# EAGLE design OpenEVSE_PLUS_v5 (EAGLE 8.5.0)
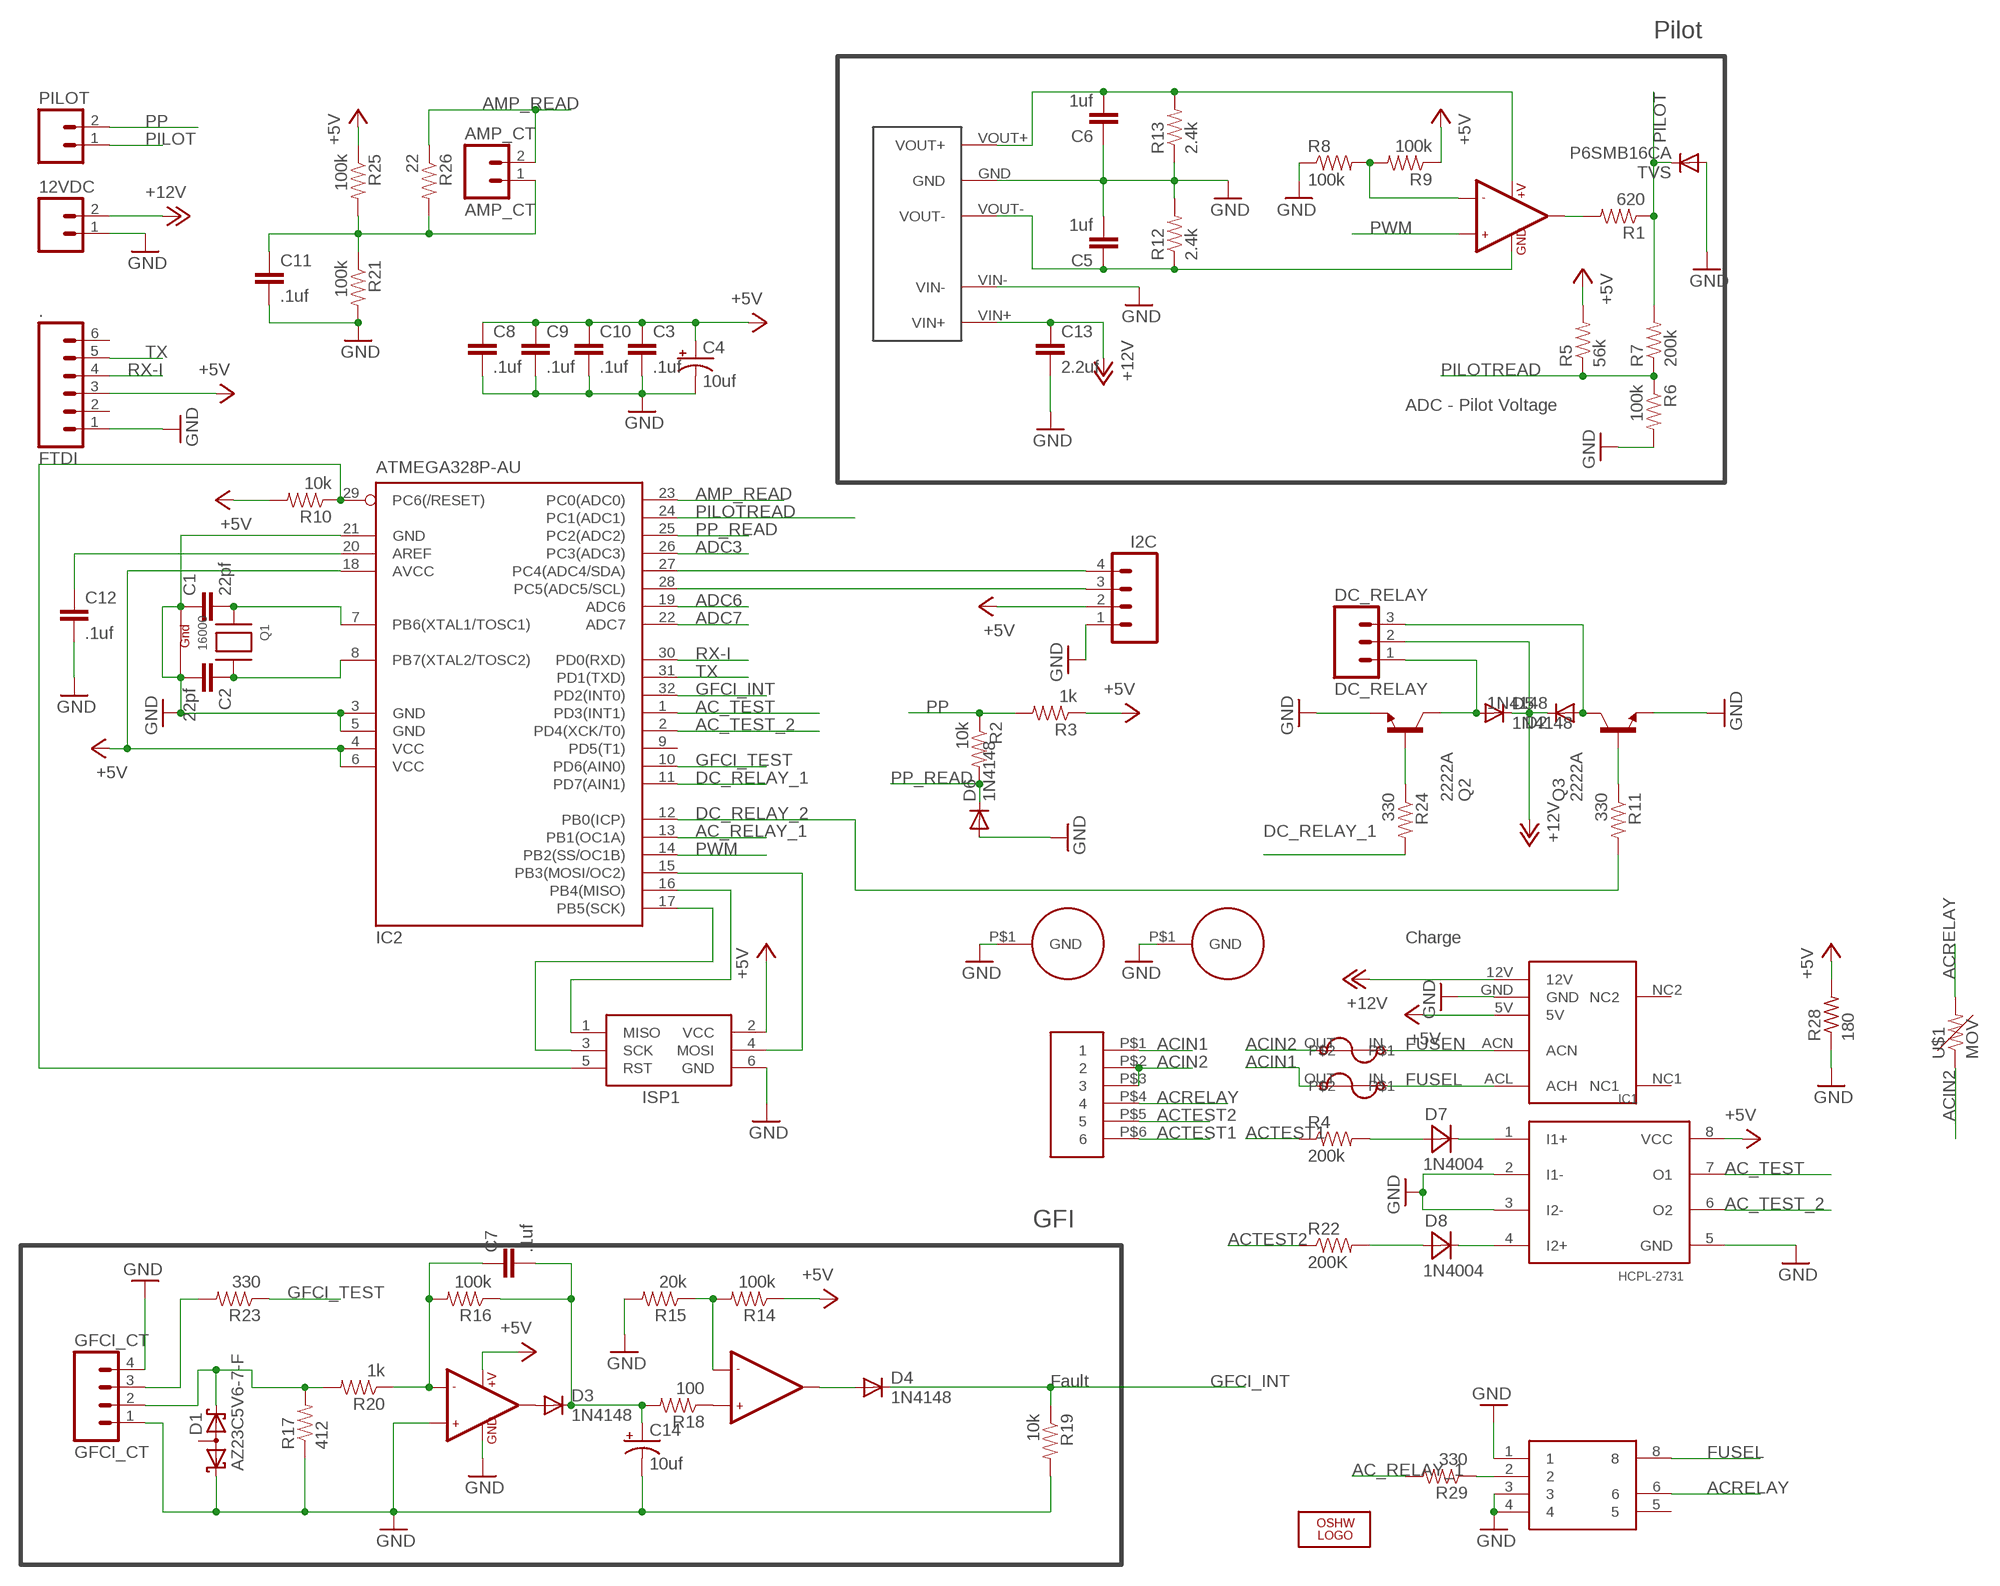
[diagram p0: schematic, sheet 1]

## Parts
12VDC  M023.5MM  [SCREWTERMINAL-3.5MM-2]
.  FTDI  M06LOCK  [1X06_LOCK]
AC  JST-VH-6  [JST-VH-6]
AMP_CT  AMP_CT  MOLEX_2  [MOLEX_2]
C1  22pf  CAP0805  [0805]
C2  22pf  CAP0805  [0805]
C3  .1uf  CAP0805  [0805]
C4  10uf  CAP_POL1206  [EIA3216]
C5  1uf  CAP0805  [0805]
C6  1uf  CAP0805  [0805]
C7  .1uf  CAP0805  [0805]
C8  .1uf  CAP0805  [0805]
C9  .1uf  CAP0805  [0805]
C10  .1uf  CAP0805  [0805]
C11  .1uf  CAP0805  [0805]
C12  .1uf  CAP0805  [0805]
C13  2.2uf  CAP0805  [0805]
C14  10uf  CAP_POL1206  [EIA3216]
D1  AZ23C5V6-7-F  BAS40-06  [SOT23]
D2  1N4148  DIODE-SOD123  [SOD123]
D3  1N4148  DIODE-SOD123  [SOD123]
D4  1N4148  DIODE-SOD123  [SOD123]
D5  1N4148  DIODE-SOD123  [SOD123]
D6  1N4148  DIODE-SOD123  [SOD123]
D7  1N4004  MBRA340T3  [SMA]
D8  1N4004  MBRA340T3  [SMA]
DC_RELAY  DC_RELAY  MOLEX_3  [MOLEX_3]
DCDC  MD112D-12E  DCDC_SIP  [DCDC_SIP]
F1  BEL1AFUSE  [BELFUSE1A]
F2  BEL1AFUSE  [BELFUSE1A]
GFCI_CT  GFCI_CT  GFCI_4  [GFCI_4]
I2C  M04LOCK  [1X04_LOCK]
IC1  HCPL-2731  [DIP08]
IC2  ATMEGA328P-AU  MEGA8-AI  [TQFP32-08]
IC3  LM358  LMV358  [SO08]
IC4  LF353  LMV358  [SO08]
IC5  AQH1213  [DIP7]
ISP1  AVRISP-6  [AVRISP]
LOGO1  OSHW_LOGO_8MILX0150-NT  [OSHW_8X150_NOTEXT]
PILOT  M023.5MM  [SCREWTERMINAL-3.5MM-2]
PS1  MPM-04E-1205  [MPM-04E-1205]
Q1  16000  XTAL-4-3225  [NX3225]
Q2  2222A  BCX70SMD  [SOT23]
Q3  2222A  BCX70SMD  [SOT23]
R1  620  RESISTOR0805-RES  [0805]
R2  10k  RESISTOR0805-RES  [0805]
R3  1k  RESISTOR0805-RES  [0805]
R4  200k  RESISTORPTH-1/4W  [AXIAL-0.4]
R5  56k  RESISTOR0805-RES  [0805]
R6  100k  RESISTOR0805-RES  [0805]
R7  200k  RESISTOR0805-RES  [0805]
R8  100k  RESISTOR0805-RES  [0805]
R9  100k  RESISTOR0805-RES  [0805]
R10  10k  RESISTOR0805-RES  [0805]
R11  330  RESISTOR0805-RES  [0805]
R12  2.4k  RESISTOR0805-RES  [0805]
R13  2.4k  RESISTOR0805-RES  [0805]
R14  100k  RESISTOR0805-RES  [0805]
R15  20k  RESISTOR0805-RES  [0805]
R16  100k  RESISTOR0805-RES  [0805]
R17  412  RESISTOR0805-RES  [0805]
R18  100  RESISTOR0805-RES  [0805]
R19  10k  RESISTOR0805-RES  [0805]
R20  1k  RESISTOR0805-RES  [0805]
R21  100k  RESISTOR0805-RES  [0805]
R22  200K  RESISTORPTH-1/4W  [AXIAL-0.4]
R23  330  RESISTOR0805-RES  [0805]
R24  330  RESISTOR0805-RES  [0805]
R25  100k  RESISTOR0805-RES  [0805]
R26  22  RESISTOR0805-RES  [0805]
R28  180  R-US_R1206  [R1206]
R29  330  RESISTOR0805-RES  [0805]
TVS  P6SMB16CA  DIODE-SMB  [SMB]
U$1  MOV  [MOV]
U$3  HOLE  [HOLE]
U$4  HOLE  [HOLE]

## Nets
12V: C6.2 DCDC.VOUT+ IC4.8(+V) R13.2
+5V: ..3 C3.1 C4.A(+) C8.1 C9.1 C10.1 I2C.2 IC1.8(VCC) IC2.4(VCC) IC2.6(VCC) IC2.18(AVCC) IC3.8(+V) ISP1.2(VCC) PS1.5V R3.1 R5.2 R9.1 R10.2 R14.1 R25.1 R28.2
+12V: 12VDC.2 C13.1 D2.C D5.C DC_RELAY.2 DCDC.VIN+ PS1.12V
-12V: C5.1 DCDC.VOUT- IC4.4(GND) R12.1
AC_RELAY_1: IC2.13(PB1(OC1A)) R29.2
AC_TEST: IC1.7(O1) IC2.1(PD3(INT1))
AC_TEST_2: IC1.6(O2) IC2.2(PD4(XCK/T0))
ACIN1: AC.P$1 F2.OUT
ACIN2: AC.P$2 AC.P$3 F1.OUT U$1.P$1
ACRELAY: AC.P$4 IC5.6 U$1.P$2
ACTEST1: AC.P$6 R4.P$1
ACTEST2: AC.P$5 R22.P$1
ADC3: IC2.26(PC3(ADC3))
ADC6: IC2.19(ADC6)
ADC7: IC2.22(ADC7)
AMP_READ: AMP_CT.2 IC2.23(PC0(ADC0)) R26.1
DC_RELAY_1: IC2.11(PD7(AIN1)) R24.2
DC_RELAY_2: IC2.12(PB0(ICP)) R11.2
FUSEL: F2.IN IC5.8 PS1.ACL(ACH)
FUSEN: F1.IN PS1.ACN
GFCI_INT: D4.C IC2.32(PD2(INT0)) R19.1
GFCI_TEST: IC2.10(PD6(AIN0)) R23.1
GND: 12VDC.1 ..1 C1.1 C2.2 C3.2 C4.C(-) C5.2 C6.1 C8.2 C9.2 C10.2 C11.2 C12.2 C13.2 C14.C(-) D1.1(K1) D6.A DCDC.GND DCDC.VIN- GFCI_CT.1 GFCI_CT.4 I2C.1 IC1.2(I1-) IC1.3(I2-) IC1.5(GND) IC2.3(GND) IC2.5(GND) IC2.21(GND) IC3.3(+IN1) IC3.4(GND) IC5.1 IC5.3 IC5.4 ISP1.6(GND) PS1.GND Q1.1(G1) Q1.3(G2) Q2.2(E) Q3.2(E) R6.2 R8.1 R12.2 R13.1 R15.2 R17.1 R19.2 R21.2 R28.1 TVS.A U$3.P$1(GND) U$4.P$1(GND)
N$1: D2.A DC_RELAY.3 Q3.3(C)
N$2: Q3.1(B) R11.1
N$4: C1.2 IC2.7(PB6(XTAL1/TOSC1)) Q1.2(X1)
N$5: C2.1 IC2.8(PB7(XTAL2/TOSC2)) Q1.4(X2)
N$6: D5.A DC_RELAY.1 Q2.3(C)
N$7: AMP_CT.1 C11.1 R21.1 R25.2 R26.2
N$8: C7.1 IC3.2(-IN1) R16.2 R20.1
N$9: D7.A R4.P$2
N$10: IC4.2(-IN1) R8.2 R9.2
N$11: IC4.1(OUT1) R1.2
N$12: D7.C IC1.1(I1+)
N$13: D8.C IC1.4(I2+)
N$14: IC2.15(PB3(MOSI/OC2)) ISP1.4(MOSI)
N$15: IC2.17(PB5(SCK)) ISP1.3(SCK)
N$16: IC2.16(PB4(MISO)) ISP1.1(MISO)
N$17: D8.A R22.P$2
N$18: IC5.2 R29.1
N$20: D1.2(K2) GFCI_CT.2 R17.2 R20.2
N$21: D3.A IC3.1(OUT1)
N$22: GFCI_CT.3 R23.2
N$23: C7.2 C14.A(+) D3.C R16.1 R18.2
N$24: IC3.6(-IN2) R14.2 R15.1
N$25: D4.A IC3.7(OUT2)
N$26: IC3.5(+IN2) R18.1
N$30: Q2.1(B) R24.1
N$39: I2C.4 IC2.27(PC4(ADC4/SDA))
N$40: I2C.3 IC2.28(PC5(ADC5/SCL))
N$44: C12.1 IC2.20(AREF)
PILOT: PILOT.1 R1.1 R7.2 TVS.C
PILOTREAD: IC2.24(PC1(ADC1)) R5.1 R6.1 R7.1
PP: PILOT.2 R2.1 R3.2
PP_READ: D6.C IC2.25(PC2(ADC2)) R2.2
PWM: IC2.14(PB2(SS/OC1B)) IC4.3(+IN1)
RST: IC2.29(PC6(/RESET)) ISP1.5(RST) R10.1
RX-I: ..4 IC2.30(PD0(RXD))
TX: ..5 IC2.31(PD1(TXD))
Unconnected: ..2 ..6 D1.3(AA) IC2.9(PD5(T1)) IC4.5(+IN2) IC4.6(-IN2) IC4.7(OUT2) IC5.5 PS1.NC1 PS1.NC2

## Notes on the sheet
- Pilot
- ADC - Pilot Voltage
- Charge
- GFI
- Fault

## Library data of the parts
12VDC PILOT = SparkFun-Connectors:M02: Standard 2-pin 0.1" header. Use with - straight break away headers ( PRT-00116) - right angle break away headers (PRT-00553) - swiss pins (PRT-00743) - machine pins (PRT-00117) - female headers (PRT-00115) Molex polarized connector foot print use with: PRT-08233 with associated crimp pins and housings. 2.54_SCREWTERM for use with PRT-10571. 3.5mm Screw Terminal footprints for PRT-08084 5mm Screw Terminal footprints for use with PRT-08432; PROD_ID: CONN-08399
. = SparkFun:M06: Header 6 Standard 6-pin 0.1" header. Use with straight break away headers (SKU : PRT-00116), right angle break away headers (PRT-00553), swiss pins (PRT-00743), machine pins (PRT-00117), and female headers (PRT-00115). Molex polarized connector foot print use with SKU : PRT-08094 with associated crimp pins and housings. NOTES ON THE VARIANTS LOCK and LOCK_LONGPADS... This footprint was designed to help hold the alignment of a through-hole component (i.e. 6-pin header) while soldering it into place. You may notice that each hole has been shifted either up or down by 0.005 of an inch from it's more standard position (which is a perfectly straight line). This slight alteration caused the pins (the squares in the middle) to touch the edges of the holes. Because they are alternating, it causes a "brace" to hold the component in place. 0.005 has proven to be the perfect amount of "off-center" position when using our standard breakaway headers. Although looks a little odd when you look at the bare footprint, once you have a header in there, the alteration is very hard to notice. Also, if you push a header all the way into place, it is covered up entirely on the bottom side. This idea of altering the position of holes to aid alignment will be further integrated into the Sparkfun Library for other footprints. It can help hold any component with 3 or more connection pins.
AC = OpenEVSE:JST-VH-6
AMP_CT = OpenEVSE:MOLEX_2
C1-C3 C5-C13 = SparkFun:CAP: Capacitor Standard 0603 ceramic capacitor, and 0.1" leaded capacitor.
C4 C14 = SparkFun:CAP_POL: Capacitor Polarized These are standard SMD and PTH capacitors. Normally 10uF, 47uF, and 100uF in electrolytic and tantalum varieties. Always verify the external diameter of the through hole cap, it varies with capacity, voltage, and manufacturer. The EIA devices should be standard.
D1 = diode:BAS40-06: Silicon Schottky Diodes General-purpose diode for high-speed switching
D2-D6 TVS = diode:DIODE-: DIODE
D7 D8 = diode:MBRA340T3: Surface Mount Schottky Power Rectifier Source: http://www.onsemi.com/pub_link/Collateral/MBRA340T3-D.PDF
DC_RELAY = OpenEVSE:MOLEX_3
DCDC = Qxd:DCDC_SIP
F1 F2 = Qxd:BEL1AFUSE
GFCI_CT = OpenEVSE:GFCI_4
I2C = SparkFun:M04: Header 4 Standard 4-pin 0.1" header. Use with straight break away headers (SKU : PRT-00116), right angle break away headers (PRT-00553), swiss pins (PRT-00743), machine pins (PRT-00117), and female headers (PRT-00115). Molex polarized connector foot print use with SKU : PRT-08231 with associated crimp pins and housings. 1MM SMD Version SKU: PRT-10208
IC1 = Qxd:HCPL-2731
IC2 = atmel:MEGA8: MICROCONTROLLER 8 Kbytes FLASH, 1 kbytes SRAM, 512 bytes EEPROM, USART, 6-channel 10 bit ADC, 2-channel 8 bit ADC Pin compatible with Atmega48, ATMega88, ATMega168 Source: avr.lbr; MPN: ATMEGA8-16AU; OC_FARNELL: 9171371; OC_NEWARK: 73M8863
IC3 IC4 = SparkFun:LMV358
IC5 = SparkFun:AQH1213
ISP1 = adafruit:AVRISP: AVR ISP HEADER Standard 6 pin header for AVR programming
LOGO1 = ohw-logo:OSHW_LOGO_8MIL
PS1 = Qxd:MPM-04E-1205
Q1 = adafruit:XTAL-4: Classic 4-pin 3.2 x 2.5mm crystal
Q2 Q3 = transistor-npn:BCX70*: NPN Transistor
R1-R26 R29 = SparkFun:RESISTOR: Resistor Basic schematic elements and footprints for 0603, 1206, and PTH resistors.
R28 = rcl:R-US_: RESISTOR, American symbol
U$1 = OpenEVSE:MOV
U$3 U$4 = OpenEVSE:HOLE

## Board
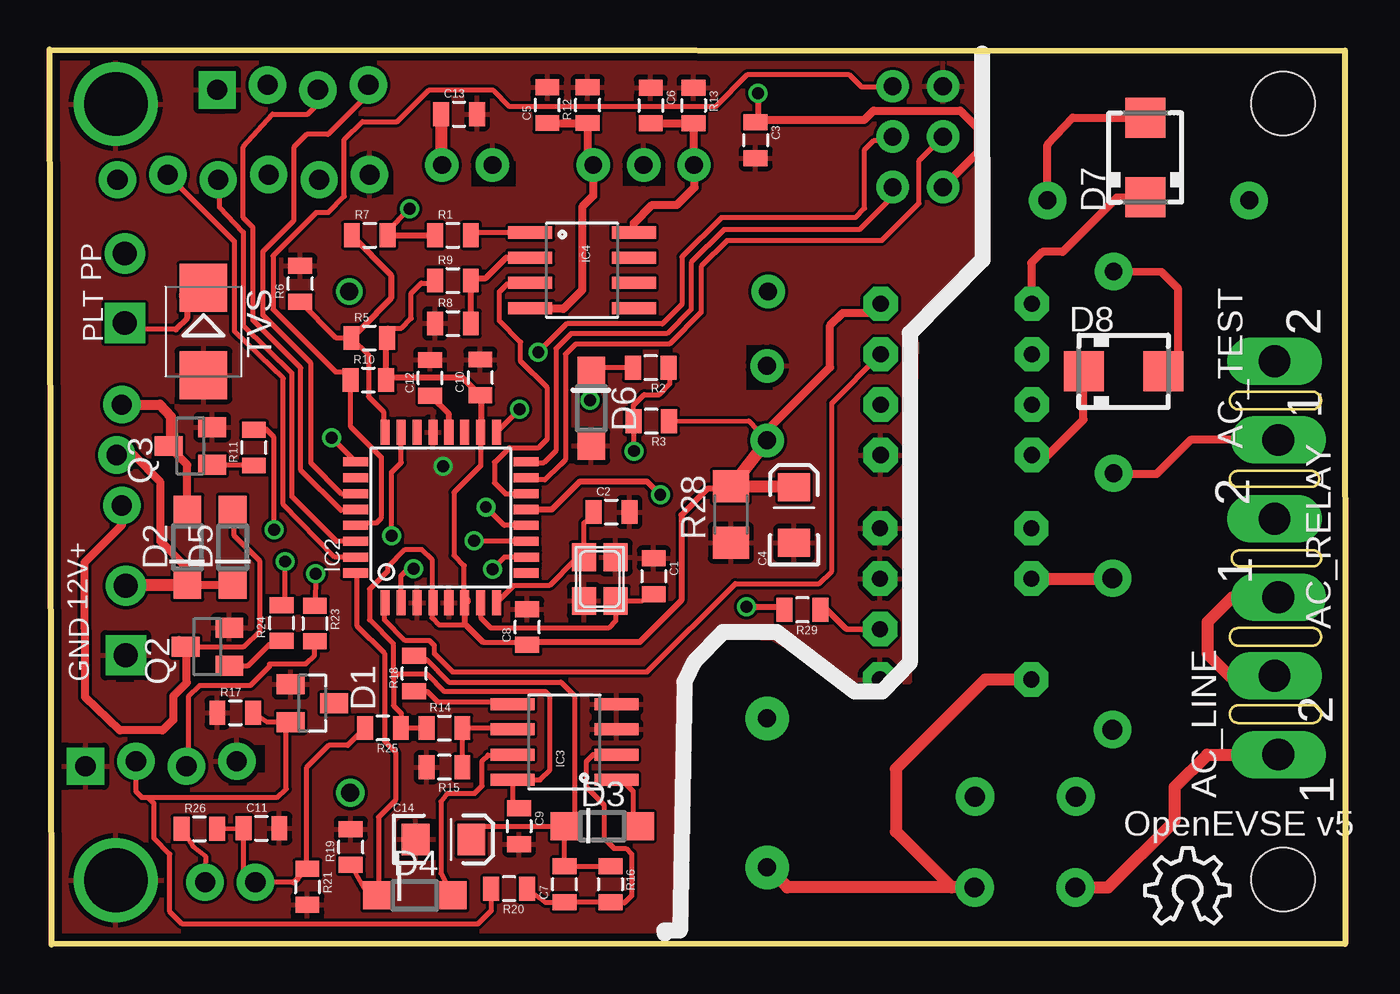
[diagram p1: board, top side]
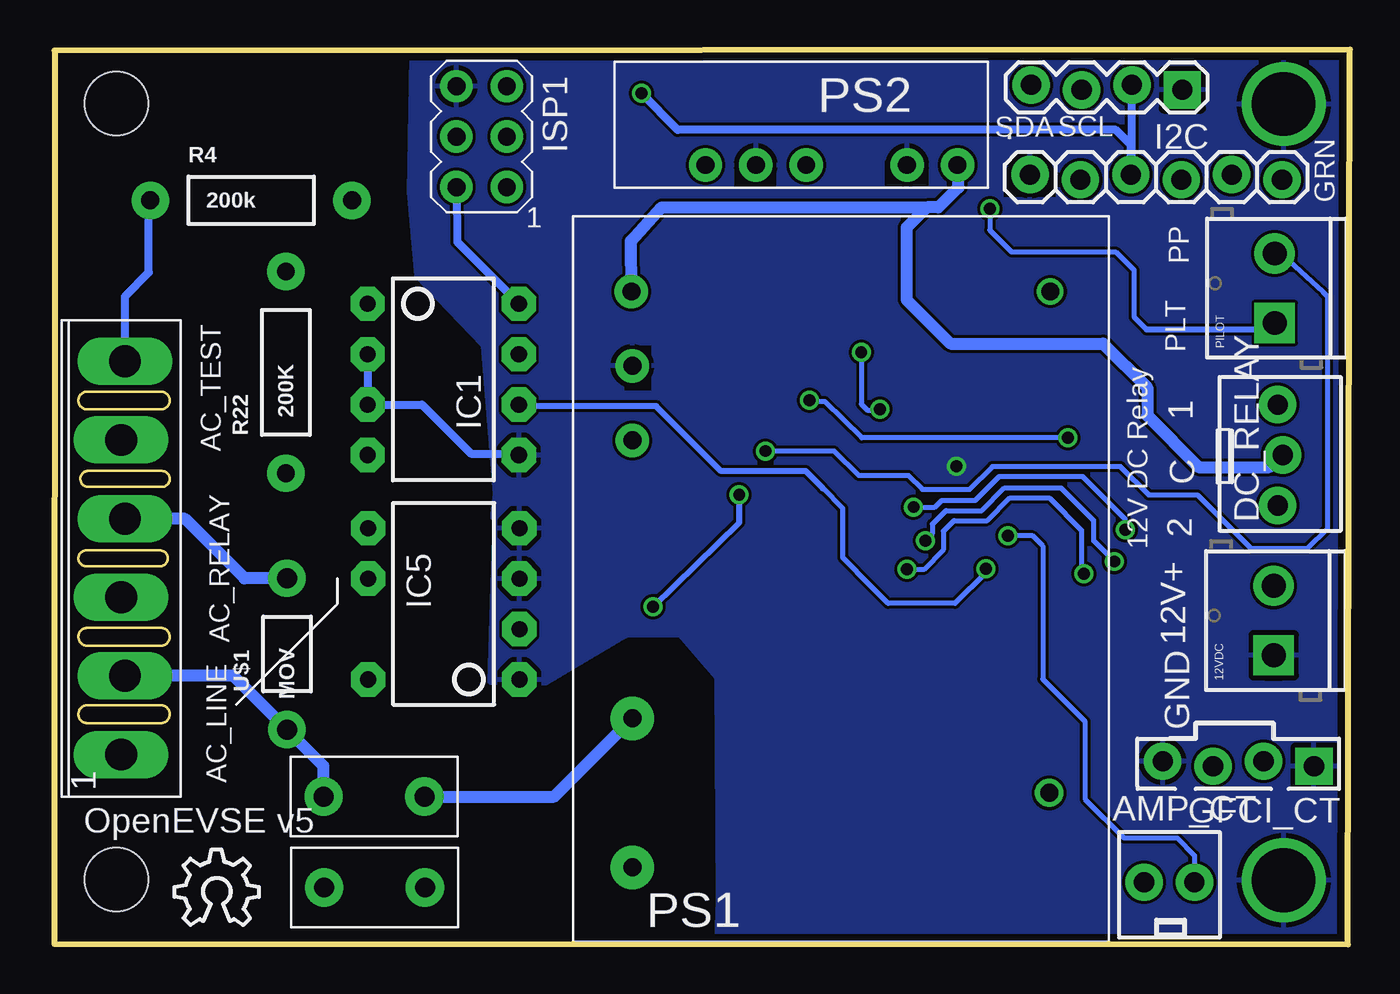
[diagram p2: board, bottom side, seen from below]

Size 65.27 x 45.06 mm. Coordinates in mm from the lower left corner, seen from the top.
Outline: 65.25,45 65.27,0.03 0.1,0 0,45.06 65.25,45
Copper layers (1*16): Top 0.0356mm / dielectric 1.5011mm / Bottom 0.0356mm
Design rules "default": minimum track width 6mil, minimum drill 13mil, track to track 6mil, track to pad 6mil, pad to pad 6mil, via to via 6mil, smd to smd 6mil, copper to edge 15mil, drill to drill 6mil, minimum pad ring 7mil, minimum via ring 7mil, stop-mask expansion 4mil, vias tented up to drill 0mil, thermal gap 10mil
Holes 3.2 mm at 62.13,42.33 62.14,3.27
tRestrict: area 8.1,41.8 to 8.8,44.2; area 14.9,37.8 to 17.3,39; area 21.3,38.2 to 23.5,39.4; area 28.9,38.2 to 31,39.4; area 35.1,27.9 to 36.4,30.2; area 9,8 to 9.9,9.4; area 9,8.1 to 9.9,9.2; area 9.9,8.7 to 10.8,10; area 3.4,14.6 to 4.2,15.8; area 3.4,13.2 to 4.2,14.4
bRestrict: area 8.1,41.8 to 8.7,44.2; area 14.8,37.6 to 17.4,38.9; area 21.2,38.2 to 23.4,39.5; area 28.9,38.1 to 31,39.5; area 35.2,27.9 to 36.5,30.2; area 3.4,14.7 to 4.3,15.8; area 3.4,13.3 to 4.3,15.4

### Footprints (pad centres in the part's own frame; a part is rotated, then mirrored left to right if it is on the bottom)
SCREWTERMINAL-3.5MM-2 = drill 1.2 pad 2.032 square: 1 0,0 | drill 1.2 pad 2.032: 2 3.5,0
1X06_LOCK = drill 1.016 pad 1.88: 1 0,0; 2 2.54,-0.254; 3 5.08,0; 4 7.62,-0.254; 5 10.16,0; 6 12.7,-0.254
JST-VH-6 = drill 1.6 pad 1.93 long: P$1 0,11.88; P$2 -0.2,7.92; P$3 0,3.96; P$4 -0.2,0; P$5 0,-3.96; P$6 -0.2,-7.92
MOLEX_2 = drill 1.016 pad 1.88: 1 -1.27,0; 2 1.27,0
0805 = smd 0.8 x 1.2: 1 -0.9,0; 2 0.9,0
EIA3216 = smd 1.4 x 1.6: A 1.4,0; C -1.4,0
SOT23 = smd 1 x 1.4: 1 -0.95,-1.1; 2 0.95,-1.1; 3 0,1.1
SOD123 = smd 1.4 x 1.4: A 1.9,0; C -1.9,0
SMA = smd 2 x 2: A 2,0; C -2,0
MOLEX_3 = drill 1.016 pad 1.88: 1 -2.54,0.127; 2 0,-0.127; 3 2.54,0.127
DCDC_SIP = drill 0.9 pad 1.676: GND 10.16,0; VIN+ 0,0; VIN- 2.54,0; VOUT+ 12.7,0; VOUT- 7.62,0
BELFUSE1A = drill 1 pad 1.93: IN 2,1.66; OUT 2,6.74
GFCI_4 = drill 1.016 pad 1.88 square: 1 0,0.127 | drill 1.016 pad 1.88: 2 2.54,-0.127; 3 5.08,0.127; 4 7.62,-0.127
1X04_LOCK = drill 1.016 pad 1.88 square: 1 0,0.127 | drill 1.016 pad 1.88: 2 2.54,-0.127; 3 5.08,0.127; 4 7.62,-0.127
DIP08 = drill 0.813 pad 1.727 octagon: 1 -3.81,-3.81; 2 -1.27,-3.81; 3 1.27,-3.81; 4 3.81,-3.81; 5 3.81,3.81; 6 1.27,3.81; 7 -1.27,3.81; 8 -3.81,3.81
TQFP32-08 = smd 1.27 x 0.457: 1 -4.293,2.8; 2 -4.293,2; 3 -4.293,1.2; 4 -4.293,0.4; 5 -4.293,-0.4; 6 -4.293,-1.2; 7 -4.293,-2; 8 -4.293,-2.8; 17 4.293,-2.8; 18 4.293,-2; 19 4.293,-1.2; 20 4.293,-0.4; 21 4.293,0.4; 22 4.293,1.2; 23 4.293,2; 24 4.293,2.8 | smd 0.457 x 1.27: 9 -2.8,-4.293; 10 -2,-4.318; 11 -1.2,-4.293; 12 -0.4,-4.293; 13 0.4,-4.293; 14 1.2,-4.293; 15 2,-4.293; 16 2.8,-4.293; 25 2.8,4.293; 26 2,4.293; 27 1.2,4.293; 28 0.4,4.293; 29 -0.4,4.293; 30 -1.2,4.293; 31 -2,4.293; 32 -2.8,4.293
SO08 = smd 0.61 x 2.21: 1 -1.905,-2.616; 2 -0.635,-2.616; 3 0.635,-2.616; 4 1.905,-2.616; 5 1.905,2.616; 6 0.635,2.616; 7 -0.635,2.616; 8 -1.905,2.616
DIP7 = drill 0.813 pad 1.727 octagon: 1 -3.81,-3.81; 2 -1.27,-3.81; 3 1.27,-3.81; 4 3.81,-3.81; 5 3.81,3.81; 6 1.27,3.81; 8 -3.81,3.81
AVRISP = drill 0.9 pad 1.626: 1 -1.27,2.54; 2 1.27,2.54; 3 -1.27,0; 4 1.27,0; 5 -1.27,-2.54; 6 1.27,-2.54
MPM-04E-1205 = drill 0.9 pad 1.676: 5V 3,25.25; 12V 2.95,32.75; GND 3,29 | drill 0.9 pad 2.184: ACL 3,3.75; ACN 3,11.25 | drill 0.9 pad 1.422: NC1 24,7.5 | drill 0.9: NC2 24.05,32.75
NX3225 = smd 1.4 x 1.2: 1 -1.1,0.8; 2 1.1,0.8; 3 1.1,-0.8; 4 -1.1,-0.8
AXIAL-0.4 = drill 0.9 pad 1.88: P$1 -5.08,0; P$2 5.08,0
R1206 = smd 1.6 x 1.803: 1 -1.422,0; 2 1.422,0
SMB = smd 2.4 x 2.4: A 2.2,0; C -2.2,0
MOV = drill 1 pad 1.88: P$1 -8.89,2.54; P$2 -1.27,2.54
HOLE = drill 3.2 pad 3.81: P$1 0,0

### Placement (x,y rotation side)
12VDC  3.84,14.56 90 bottom
.  16.11,38.76 0 bottom
AC  61.91,21.44 180 bottom
AMP_CT  9.1,3.13 0 bottom
C1  30.43,18.54 270 top
C2  28.31,21.77 0 top
C3  35.57,40.49 270 top
C4  37.5,21.62 90 top
C5  25.07,42.26 90 top
C6  30.28,42.25 270 top
C7  25.94,3.02 90 top
C8  24.06,15.98 90 top
C9  23.65,5.95 270 top
C10  21.7,28.55 90 top
C11  10.67,5.84 0 top
C12  19.17,28.53 90 top
C13  20.63,41.81 0 top
C14  19.84,5.28 0 top
D1  13.24,12.14 270 top
D2  6.94,19.99 90 top
D3  27.84,5.95 0 top
D4  18.39,2.47 0 top
D5  9.23,19.99 90 top
D6  27.28,27 270 top
D7  55.2,39.63 90 top
D8  54.11,28.86 0 top
DC_RELAY  3.51,24.64 90 bottom
DCDC  19.77,39.24 180 bottom
F1  44.96,5.44 90 bottom
F2  44.94,0.87 90 bottom
GFCI_CT  1.81,9.09 180 bottom
I2C  8.44,43.16 180 bottom
IC1  45.67,28.45 270 bottom
IC2  19.71,21.5 90 top
IC3  25.94,10.19 90 top
IC4  26.82,33.95 270 top
IC5  45.65,17.15 90 bottom
ISP1  43.74,40.68 180 bottom
LOGO1  55.2,1.04 0 top
LOGO2  OSHW_LOGO_8MILX0150-NT  [OSHW_8X150_NOTEXT]  59.21,0.97 0 bottom
PILOT  3.79,31.29 90 bottom
PS1  39.15,0.13 0 bottom
Q1  27.72,18.39 270 top
Q2  7.96,14.99 90 top
Q3  7.09,25.1 90 top
R1  20.32,35.71 0 top
R2  30.28,29.03 180 top
R3  30.31,26.34 180 top
R4  55.35,37.47 0 bottom
R5  16.1,30.53 0 top
R6  12.63,33.27 90 top
R7  16.13,35.71 0 top
R8  20.32,31.27 0 top
R9  20.32,33.43 0 top
R10  16.06,28.42 0 top
R11  10.29,25.02 90 top
R12  27.11,42.26 90 top
R13  32.44,42.25 270 top
R14  19.89,10.9 0 top
R15  19.89,8.92 180 top
R16  28.25,3.02 270 top
R17  9.35,11.66 0 top
R18  18.37,13.64 90 top
R19  15.17,4.9 90 top
R20  23.14,2.8 180 top
R21  12.98,2.9 270 top
R22  53.6,28.81 90 bottom
R23  13.37,16.16 270 top
R24  11.69,16.18 90 top
R25  16.79,10.9 180 top
R26  7.55,5.82 0 top
R28  34.32,21.64 90 top
R29  37.93,16.84 180 top
TVS  7.75,30.86 270 top
U$1  51,19.7 90 bottom
U$3  3.33,42.32 0 top
U$4  3.33,3.23 0 top

### Tracks (layer width: path | path; a pad name or v marks a point on that pad's centre or on a via)
12V
  Top 0.254: 32.47,41.33 32.38,41.4 R13.2
  Top 0.305: 32.47,41.33 32.31,41.43
  Top 0.406: C6.2 R13.2 32.47,41.32 DCDC.VOUT+ 32.49,39.22 32.49,38.13 31.6,37.24 30.36,37.24 29.44,36.32 IC4.8
+5V  (via drill 0.6)
  Top 0.254: R5.2 17.03,31.04 17.73,31.04 18.22,31.52 18.22,32.79 18.73,33.3 19.49,33.3 19.49,33.36 R9.1 | IC2.18 21.77,25.85 | 21.01,16.79 21.01,17.11 IC2.6 20.88,17.23 | 17.4,13.67 17.51,13.56 17.53,13.59 19.03,13.59 19.89,12.73 24.97,12.73 25.2,12.5 25.2,8.79 24.72,8.31 24.72,8.28 IC3.8 23.32,7.16 23.51,6.97 23.52,6.97 C9.1 | 17.4,13.67 17.33,13.74 | 17.33,13.59 17.33,15.11 16.11,16.33 16.11,17.88 17.05,18.82 17.05,19.03 17.91,19.89 18.75,19.89 19.26,19.38 19.26,16.61 | 17.33,13.59 17.4,13.67 | 20.88,17.17 20.88,17.23 | 20.88,17.23 20.88,19.08 20.38,19.59 20.38,22.76 21.71,24.1 IC2.18 | 31.17,26.52 R3.1 35.21,26.37 PS1.5V | C8.1 24.06,15.14 24.14,15.22 | 19.26,17.26 IC2.4 19.31,16.67 19.26,16.61 | 19.26,16.61 19.26,16.44 19.59,16.11 20.91,16.11 20.93,16.13 | 17.33,13.59 17.33,12.02 17.71,11.63 17.71,10.91 R25.1 R14.1 | IC2.18 21.73,25.81 21.77,25.81 | 21.85,15.22 24.58,15.22
  Top 0.305: 20.95,17.16 IC2.6 20.93,17.18 20.93,16.13 21.85,15.22 | R5.2 16.96,30.82 R10.2 17.09,28.55 20.8,28.55 C10.1 21.77,27.57 21.77,25.81 | 24.14,15.22 24.58,15.22 29.72,15.22 31.83,17.32 31.83,21.62 33.18,22.96 34.22,22.96 R28.2 | v35.69,42.85 35.69,41.52 C3.1
  Top 0.406: IC2.6 21.01,17.3 | 21.01,17.3 20.88,17.17 | 35.69,41.52 41.04,41.52 41.51,41.99 45.88,41.99 46.74,41.12 46.74,39.87 ISP1.2 | PS1.5V 36.08,25.81 39.32,29.06 39.32,31.17 39.96,31.8 41.41,31.8 IC1.8
  Top 0.61: C4.A 37.28,23.06 R28.2 34.45,23.19 PS1.5V
  Bottom 0.406: I2C.2 11,43.28 11,38.79 ..3 11.03,40.27 11.79,41.02 33.86,41.02 v35.69,42.85 | ISP1.2 44.99,38.11 44.96,35.36 IC1.8
+12V
  Top 0.254: C13.1 19.73,41.72 19.82,41.58
  Top 0.406: 19.82,41.58 19.64,41.96 19.74,42.06 | D5.C D2.C | 6.82,18.09 6.89,18.16 6.89,19 5.59,20.3 5.59,23.27 4.27,24.64 DC_RELAY.2
  Top 0.61: 12VDC.2 4.59,18.09 6.82,18.09 D2.C | C13.1 19.73,39.28 DCDC.VIN+
  Bottom 0.61: PS1.12V 36.22,35.41 34.68,37.11 21.32,37.11 | 21.32,37.11 20.73,37.11 19.72,38.13 19.72,39.19 DCDC.VIN+ | 21.32,37.11 22.33,36.09 22.33,32.46 20.12,30.25 12.43,30.25 10.22,28.04 10.22,26.62 7.62,24.03 4.07,24.03 DC_RELAY.2
-12V
  Top 0.254: 27.04,41.36 R12.1
  Top 0.305: 27.04,41.36 27.11,41.43 R12.1
  Top 0.406: C5.1 R12.1 27.11,39.52 DCDC.VOUT- 27.39,37.7 26.83,37.14 26.83,32.95 25.89,32.01 24.24,32.01 IC4.4
AC_RELAY_1  (via drill 0.6)
  Top 0.305: IC2.13 25.31,21.9 26.73,23.32 30.08,23.32 v30.77,22.63 | v35.11,16.99 36.88,16.99 R29.2
  Bottom 0.305: v30.77,22.63 30.77,21.24 v35.11,16.99
AC_TEST
  Top 0.254: IC2.1 16.87,17.17 16.87,16.33 17.91,15.29 19.13,15.29 19.39,15.04 19.39,14.63 20.3,13.72 30.1,13.72 34.55,18.16 38.77,18.16 39.4,18.8 39.4,27.26 IC1.7
AC_TEST_2  (via drill 0.6)
  Top 0.254: v18.34,18.93 17.96,18.82 17.68,18.54 17.68,17.23 IC2.2
  Top 0.305: 17.67,17.17 IC2.2
  Bottom 0.254: 26.55,22.96 25.56,21.97 25.56,19.48 24.16,18.06 23.27,17.17 19.89,17.17 18.34,18.72 v18.34,18.93
  Bottom 0.305: 26.55,22.96 27.41,23.83 31.68,23.83 34.96,27.1 41.79,27.1 IC1.6
ACIN1
  Top 0.61: F2.OUT 53.32,2.87 56.68,6.23 56.68,7.93 58.31,9.56 AC.P$1
ACIN2
  Top 0.61: AC.P$3 59.57,17.48 58.32,16.23 58.32,14.64 59.44,13.52 AC.P$2
  Bottom 0.61: F1.OUT 51.7,8.97 U$1.P$1 56.25,13.52 AC.P$2
ACRELAY
  Top 0.61: IC5.6 53.53,18.42 U$1.P$2
  Bottom 0.61: U$1.P$2 55.69,18.43 58.68,21.43 AC.P$4
ACTEST1
  Bottom 0.406: AC.P$6 61.7,32.64 60.51,33.83 60.51,37.39 R4.P$1
ACTEST2
  Top 0.406: AC.P$5 57.48,25.4 55.76,23.67 53.65,23.67 R22.P$1
AMP_READ  (via drill 0.6)
  Top 0.254: v17.23,20.58 17.23,23.78 17.71,24.26 IC2.23 | R26.1 7.16,5.05 7.24,4.92 7.88,4.41 AMP_CT.2
  Bottom 0.254: v17.23,20.58 15.98,20.58 15.47,20.07 15.47,13.36 13.34,11.23 13.34,7.32 11.38,5.36 8.72,5.36 7.83,4.47 AMP_CT.2
DC_RELAY_1  (via drill 0.6)
  Top 0.254: IC2.11 21.41,20.3 v21.39,20.32 | R24.2 11.87,17.15 v11.87,19.28
  Bottom 0.254: v11.87,19.28 12.91,20.32 12.91,21.34 14.56,22.99 17.4,22.99 18.55,21.85 20.35,21.85 21.04,21.16 21.04,20.68 v21.39,20.32
DC_RELAY_2  (via drill 0.6)
  Top 0.254: IC2.12 22.9,21.1 v21.98,22.02 | v11.31,20.88 11.31,25.53 10.88,25.96 10.34,25.96 R11.2
  Bottom 0.254: v21.98,22.02 20.91,22.02 20.55,22.35 18.88,22.35 17.66,23.57 13.47,23.57 11.33,21.44 11.33,20.91 v11.31,20.88
FUSEL
  Top 0.61: F2.IN 45.45,2.87 | 45.45,2.87 37.16,2.87 PS1.ACL | IC5.8 47.12,13.34 42.63,8.84 42.63,5.69 45.45,2.87
FUSEN
  Bottom 0.61: F1.IN 40.09,7.44 PS1.ACN
GFCI_INT
  Top 0.254: 15.4,18.68 IC2.32 15.5,18.62 15.5,16.03 16.87,14.66 16.87,10.24 17.43,9.68 17.43,7.27 16.57,6.4 16.57,3.12 D4.C 16.2,2.18 R19.1
GFCI_TEST  (via drill 0.6)
  Top 0.254: IC2.10 22.91,19.5 v22.31,18.9 | v13.39,18.67 R23.1
  Bottom 0.254: v22.31,18.9 22.28,18.87 21.47,18.87 20.48,19.86 20.48,20.8 19.94,21.34 18.27,21.34 17.12,22.48 15.14,22.48 13.52,20.86 13.52,18.8 v13.39,18.67
GND  (via drill 0.6)
  Top 0.254: C14.C 18.72,5.42
  Bottom 0.406: IC1.2 IC1.3 46.74,27.18 44.28,24.72 41.94,24.72 IC1.5
  other vias: 19.82,24.08
  pour Bottom: -0.12,45.44 47.27,44.75 47.4,37.87 47.02,33.66 43.67,30.15 43.06,22.66 43.21,21.49 43.11,21.69 43.08,21.34 43.34,13.21 40.52,13.16 36.44,15.56 33.77,15.59 31.91,13.41 31.83,2.21 31.9,0.23 30.66,0.13 29.96,0.21 17.99,0.31 7.64,0.01 0.15,0.06
  pour Top: 0.1,45.22 4.1,45.51 46.76,45.2 47.09,44.45 47.1,34.42 43.41,30.74 43.41,30.61 43.67,30.33 43.31,13.21 40.39,13.13 40.01,13.41 36.43,15.39 33.94,15.5 31.9,13.54 31.9,0.36 30.79,0.43 24.93,0.43 0.09,0.01 0.1,28.97
N$1
  Top 0.406: 5.92,25.03 Q3.3 6.11,24.98 6.94,24.15 D2.A
  Top 0.508: DC_RELAY.3 5.57,27.18 6.11,26.59 6.11,24.98
N$2
  Top 0.254: Q3.1 10.26,24.15 R11.1
N$4
  Top 0.254: C1.2 29.83,17.29 Q1.2 28.52,16.3 28.15,15.93 22.23,15.93 21.75,16.41 21.75,17.17 IC2.7
N$5
  Top 0.254: Q1.4 26.92,21.22 27.23,21.49 27.23,21.6 C2.1 | Q1.4 27.01,19.36 | Q1.4 26.5,19.36 26.48,19.36 25.18,18.06 23.37,18.06 IC2.8
N$6
  Top 0.254: Q2.3 9.78,14.99 10.6,15.8 10.6,19.28 9.3,20.58 9.3,21.19 9.62,21.5
  Top 0.305: 9.62,21.5 D5.A
  Top 0.406: 6.71,14.85 Q2.3 | 6.52,15.32 Q2.3 | Q2.3 6.91,14.93 6.91,13.18 6.23,12.5 6.23,11.3 5.69,10.77 3.54,10.77 1.78,12.45 1.76,19.23 3.64,21.11 DC_RELAY.1
N$7
  Top 0.254: R25.2 15.02,10.02 14.06,10.02 12.93,8.89 12.93,3.85 R21.1 12.52,3.33 | R26.2 C11.1 9.77,3.8 AMP_CT.1 12.31,3.13
  Top 0.305: 12.52,3.33 12.31,3.13
N$8
  Top 0.254: R16.2 C7.1 | 28.23,2.01 28.23,2.1 R16.2 | 25.9,2.08 C7.1 | C7.1 25.92,2.11 24.97,2.11 24.01,2.82 R20.1 | IC3.2 27.39,9.55 27.03,9.2 27.03,7.93 27.92,7.04 27.92,5.34 28.43,4.83 29.04,4.83 29.32,4.55 29.32,2.44 28.96,2.08 28.29,2.08 R16.2
N$9
  Top 0.406: R4.P$2 50.27,40.26 51.54,41.63 54.13,41.63 D7.A
N$10
  Top 0.305: 20.97,30.89 R8.2 R9.2 21.09,33.55 21.97,33.55 23,34.58 IC4.2
N$11
  Top 0.254: IC4.1 21.36,35.85 R1.2
N$12
  Top 0.406: D7.C 53.76,37.6 51.03,34.88 50.02,34.88 49.46,34.32 49.46,32.29 IC1.1
N$13
  Top 0.406: IC1.4 50.3,24.64 52.08,26.43 52.08,28.83 D8.C
N$14
  Top 0.254: 24.03,23.52 IC2.15 24.11,23.39 24.95,23.39 25.71,24.13 25.99,24.41 25.99,29.72 26.5,30.23 31.22,30.23 32.82,31.83 32.82,34.14 34.12,35.44 41.91,35.44 43.8,37.31 43.8,39.46 ISP1.4
N$15  (via drill 0.6)
  Top 0.254: IC2.17 v23.68,26.95 | v24.62,29.82 26.04,31.24 30.87,31.24 31.86,32.23 31.86,34.62 33.84,36.6 40.59,36.6 41.05,37.06 41.05,40.01 41.53,40.49 42.28,40.49 ISP1.3
  Bottom 0.254: v24.62,29.82 24.62,27.21 24.31,26.9 23.73,26.9 v23.68,26.95
N$16
  Top 0.254: ISP1.1 42.32,37.99 42.32,37.52 40.8,35.99 33.96,35.99 32.31,34.34 32.31,31.98 31.09,30.76 26.27,30.76 25.51,30 25.51,24.87 24.9,24.26 24.04,24.26 IC2.16
N$17
  Top 0.406: R22.P$2 56.01,33.86 56.83,33.05 56.83,28.9 D8.A
N$18
  Top 0.305: R29.1 39.17,16.84 40.11,15.9 IC5.2
N$20
  Top 0.254: 4.96,7.39 11.44,7.39 11.92,7.83 11.92,10.85 D1.2 10.95,11.19 R17.2 | 4.96,7.39 4.65,7.39 4.35,7.7 GFCI_CT.2 | R20.2 22.25,1.69 21.57,1.02 6.68,1.02 6.05,1.65 6.05,4.55 5.26,5.34 5.26,7.09 4.96,7.39
N$21
  Top 0.254: IC3.1 28.81,8.28 29.39,7.7 29.39,6.3 D3.A
N$22
  Top 0.254: R23.2 13.34,15.23 13.34,14.56 12.91,14.12 11.08,14.12 11.08,14 10.11,13.03 7.55,13.03 6.99,12.47 6.99,9.07 GFCI_CT.3
N$23
  Top 0.254: 28.23,4.17 28.48,3.91 28.48,3.79 28.34,3.92 R16.1 C7.2 25.94,5.57 D3.C | C14.A 21.24,5.82 21.37,5.95 25.81,5.95 | 25.81,5.95 25.94,5.82 | 25.81,5.95 D3.C | D3.C 25.82,5.82 25.81,5.82 26.45,6.2 26.45,12.52 25.76,13.21 20.12,13.21 19,14.33 18.58,14.33 R18.2 18.28,14.54 18.24,14.58 | 18.24,14.58 18.19,14.58 | 18.24,14.58 18.7,14.58 18.83,14.45
N$24
  Top 0.254: R15.1 R14.2 23.25,10.9 IC3.6
N$25
  Top 0.254: D4.A 19.72,3.58 19.72,7.19 20.05,7.6 21.42,7.6 21.8,7.98 21.8,9.25 22.08,9.53 23.3,9.53 IC3.7
N$26
  Top 0.254: IC3.5 23.2,12.22 19.54,12.22 19.03,12.73 18.38,12.73 R18.1 18.43,12.68
N$30
  Top 0.254: Q2.1 10,14.04 11.05,15.09 11.5,15.09 R24.1
N$39
  Top 0.254: IC2.27 14.72,22.67 13.16,24.23 13.16,29.26 10.75,31.68 10.75,34.9 12.3,36.45 12.3,40.13 12.96,40.79 14.03,40.79 16.06,42.83 I2C.4
N$40
  Top 0.254: IC2.28 14.68,21.85 12.65,23.88 12.65,29.03 10.24,31.42 10.24,36.09 9.76,36.6 9.76,40.16 11.23,41.81 13.01,41.81 13.52,42.34 I2C.3
N$44
  Top 0.305: IC2.20 20.11,26.68 C12.1
PILOT  (via drill 0.6)
  Top 0.254: R7.2 17.03,35.92 v18.14,37.04 | 6.35,30.96 3.94,30.96 PILOT.1
  Top 0.305: R7.2 R1.1 | 6.93,32.68 6.93,31.54 6.35,30.96
  Top 0.406: 17.07,35.89 R7.2
  Top 0.813: TVS.C 6.93,32.68
  Bottom 0.254: v18.14,37.04 18.14,35.97 17.05,34.88 11.79,34.88 10.88,33.96 10.88,31.6 10.24,30.96 | 4.46,30.96 3.94,30.96 PILOT.1
  Bottom 0.305: 10.24,30.96 4.46,30.96
PILOTREAD
  Top 0.254: R5.1 16.06,29.7 16.06,27.59 16.82,26.82 16.82,25.68 16.95,25.68 16.95,25.76 IC2.24 | R5.1 14.44,30.53 R6.1 | R5.1 15.3,30.89
  Top 0.305: R7.1 15.23,35.68 17.2,33.71 17.2,32.54 16.46,31.8 16.46,31.79 R5.1
PP  (via drill 0.6)
  Top 0.254: v29.44,24.84 29.41,24.88 R3.2 29.41,27.14 29.95,27.69 30.71,27.69 31.25,28.22 31.25,28.97 R2.1
  Bottom 0.254: 3.84,34.65 3.33,34.65 1.35,32.84 1.12,32.62 1.12,20.96 2.14,19.94 4.98,19.94 7.68,22.63 10.14,22.63 11.56,24.05 18.01,24.05 19.16,22.91 21.54,22.91 22.23,23.6 24.75,23.6 25.99,24.84 v29.44,24.84 | 3.84,34.65 4.4,34.65 | PILOT.2 3.83,34.64 3.84,34.65
PP_READ  (via drill 0.6)
  Top 0.254: R2.2 27.46,29.03 D6.C 27.23,29.11 v27.23,27.41 | IC2.25 15.43,24.27 v14.2,25.5
  Bottom 0.254: v14.2,25.5 24.59,25.5 26.45,27.33 27.16,27.33 v27.23,27.41
PWM
  Top 0.254: IC4.3 24.15,33.25 23.04,33.25 22.66,32.87 22.66,31.4 23.73,30.33 23.73,29.36 25.07,28.02 25.07,25.45 24.64,25.02 23.17,25.02 22.43,24.28 22.41,24.28 22.41,23.24 22.97,22.68 23.99,22.68 IC2.14
RST
  Top 0.254: R10.1 15.17,28.54 15.17,26.06 16.72,24.51 16.72,21.49 16.44,21.21 15.53,21.21 IC2.29 | R10.1 15.16,28.59 15.17,28.6 | 15.15,28.55 R10.1 | R10.1 14.87,28.83 14.41,28.83 11.26,31.98 11.26,34.67 13.44,36.86 14.05,36.86 14.84,37.67 14.84,40.54 15.75,41.43 17.51,41.43 19.08,43 22.36,43 23.17,42.19 33.53,42.19 35.16,43.82 40.26,43.82 40.9,43.18 42.44,43.18 ISP1.5
RX-I
  Top 0.254: IC2.30 14.46,20.3 12.2,22.56 12.2,28.78 9.76,31.17 9.76,35.87 8.56,37.11 8.56,38.44 ..4
TX
  Top 0.254: IC2.31 14.37,19.5 11.77,22.15 11.77,28.5 9.33,30.86 9.3,30.89 9.3,35.41 9,35.71 ..5

### Text on the board
tNames: PP | 2 | PLT | 1 | AC_TEST | 2 | _ | _ | 1 | 12V+ | AC_RELAY | GND | 2 | AC_LINE | 1 | _ | OpenEVSE v5 | _
bNames: PS2 | SCL | SDA | GRN | PP | AC_TEST | PLT | 1 | C | AC_RELAY | 2 | 12V DC Relay | 12V+ | GND | AC_LINE | OpenEVSE v5 | PS1